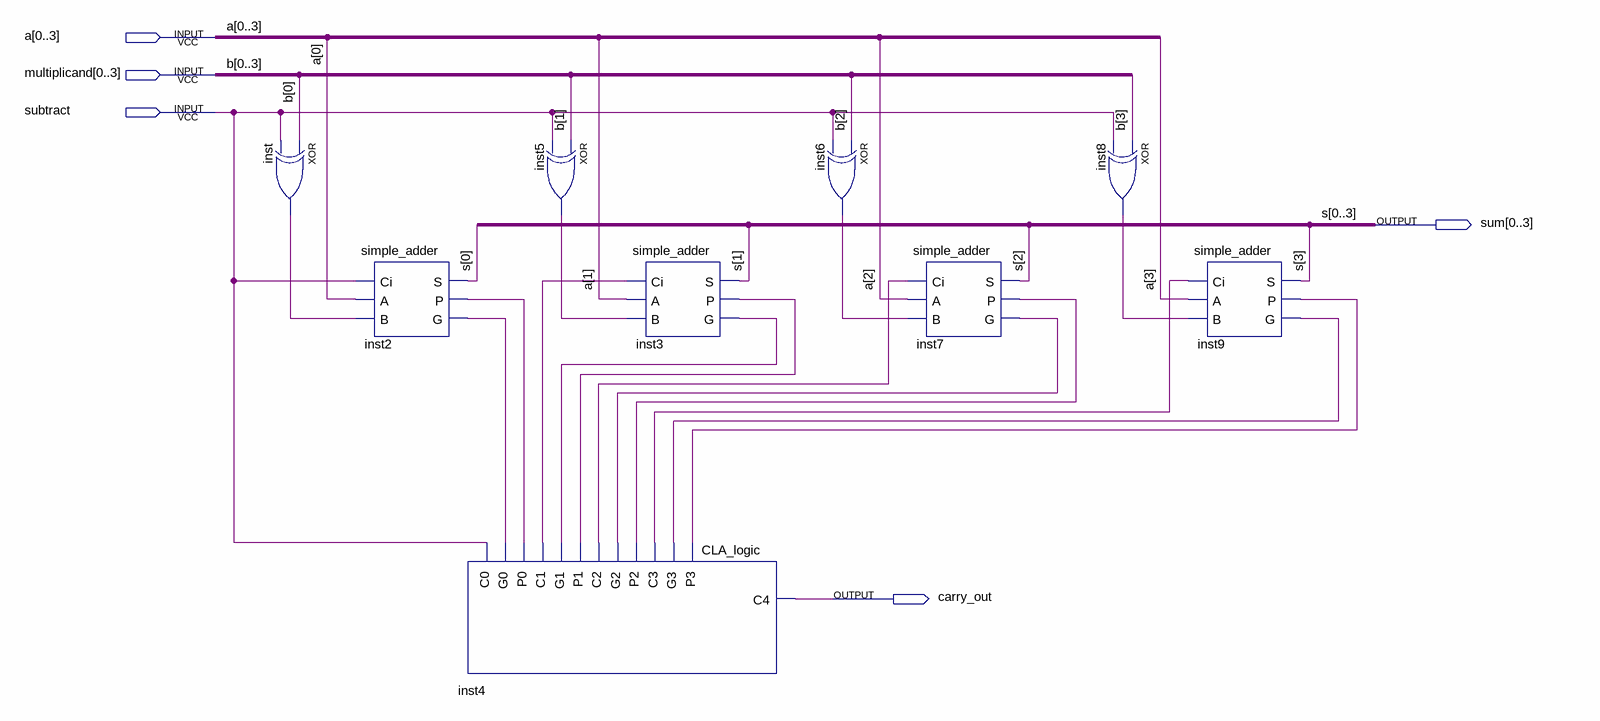
[diagram p0: schematic sheet]
// Quartus schematic adder_subtractor.bdf as structural Verilog: 9 symbols, 5 pins
module adder_subtractor (
  input  [0:3] a,
  input  [0:3] multiplicand,
  input  subtract,
  output [0:3] sum,
  output carry_out
);

  wire inst2_g, inst2_p, inst3_g, inst3_p, inst4_c1, inst4_c2, inst4_c3, inst5_out, inst6_out, inst7_g,
       inst7_p, inst8_out, inst9_g, inst9_p, inst_out;

  xor inst (inst_out, multiplicand[0], subtract);
  simple_adder inst2 (.Ci(subtract), .A(a[0]), .B(inst_out), .S(sum[0]), .P(inst2_p), .G(inst2_g));
  CLA_logic inst4 (
    .G0(inst2_g), .C0(subtract), .P0(inst2_p), .G1(inst3_g), .P1(inst3_p), .G2(inst7_g), .P2(inst7_p),
    .G3(inst9_g), .P3(inst9_p), .C1(inst4_c1), .C2(inst4_c2), .C3(inst4_c3), .C4(carry_out));
  xor inst5 (inst5_out, multiplicand[1], subtract);
  simple_adder inst3 (.Ci(inst4_c1), .A(a[1]), .B(inst5_out), .S(sum[1]), .P(inst3_p), .G(inst3_g));
  xor inst6 (inst6_out, multiplicand[2], subtract);
  simple_adder inst7 (.Ci(inst4_c2), .A(a[2]), .B(inst6_out), .S(sum[2]), .P(inst7_p), .G(inst7_g));
  xor inst8 (inst8_out, multiplicand[3], subtract);
  simple_adder inst9 (.Ci(inst4_c3), .A(a[3]), .B(inst8_out), .S(sum[3]), .P(inst9_p), .G(inst9_g));

  // Other names for the same wires on the sheet: b[3:0] = {multiplicand[3], multiplicand[2], multiplicand[1], multiplicand[0]};
  //   s[3:0] = {sum[3], sum[2], sum[1], sum[0]}
endmodule
